# Altium project PCB_Project_VSAIND.PrjPcb
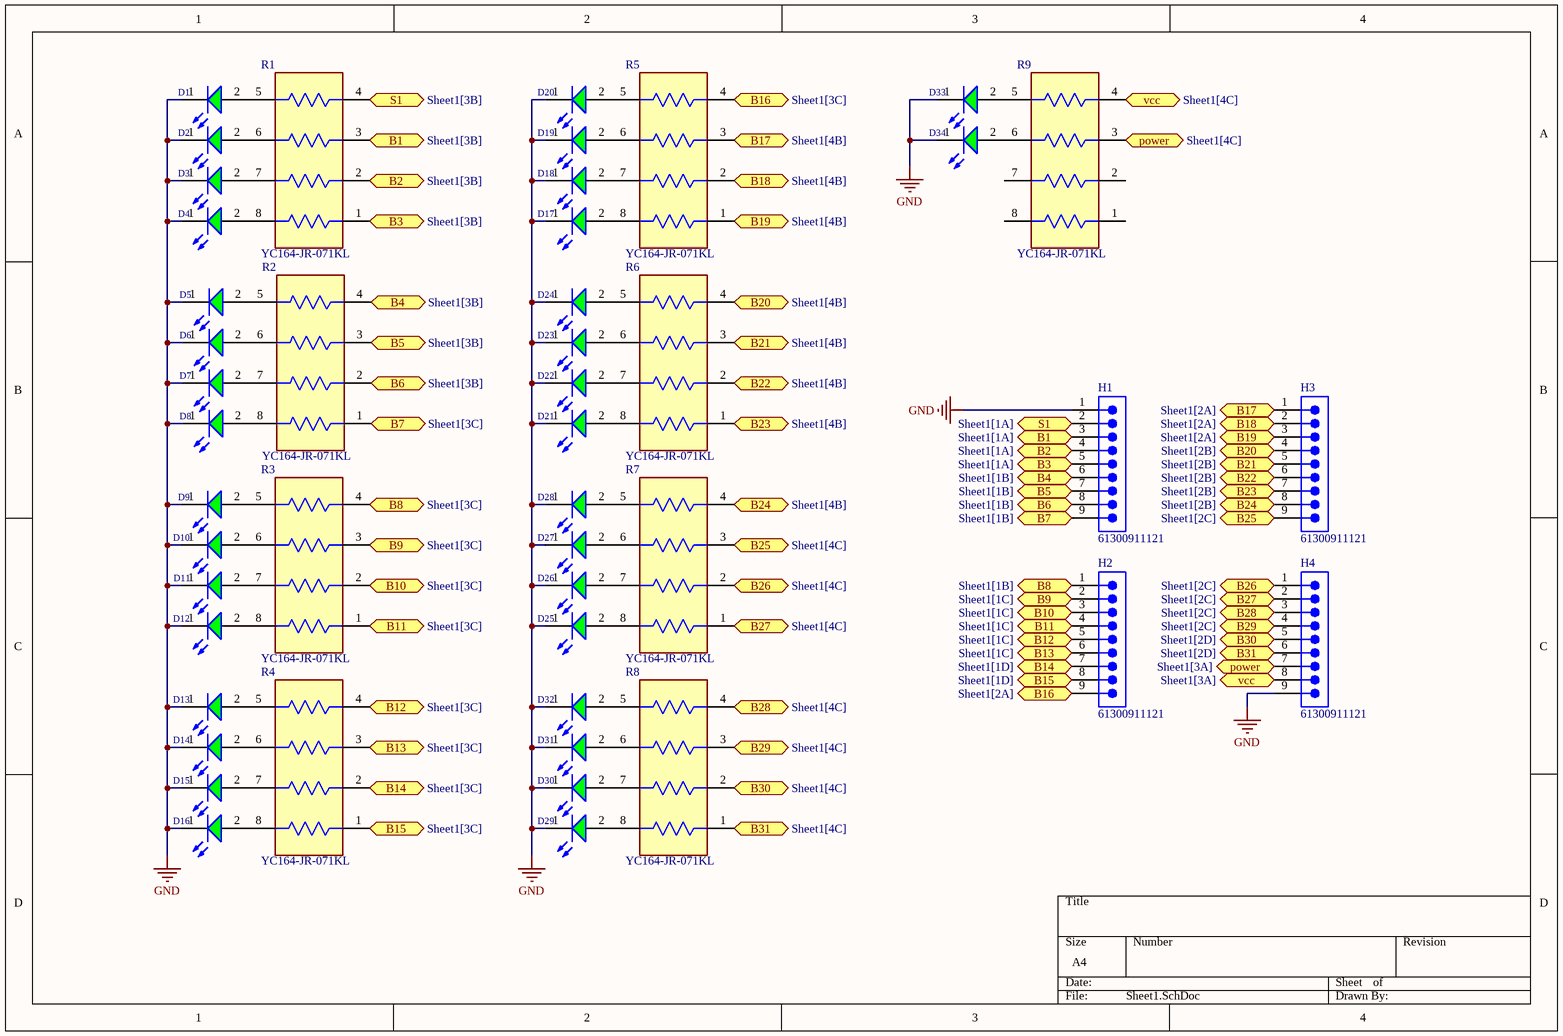
[diagram p0: Sheet1.SchDoc]
1 sheet, 47 parts. Net scope: flat (ports and power ports of the same name join across sheets).
Board file: PCB3.PcbDoc

## Sheet Sheet1.SchDoc
size A4; SheetNumber: 1; SheetTotal: 1

### Parts
D1  SHAFT  [WL-SMCW_0805_150080xx75000]  (value not drawn)
D2  B1  [WL-SMCW_0805_150080xx75000]  (value not drawn)
D3  B2  [WL-SMCW_0805_150080xx75000]  (value not drawn)
D4  B3  [WL-SMCW_0805_150080xx75000]  (value not drawn)
D5  B4  [WL-SMCW_0805_150080xx75000]  (value not drawn)
D6  B5  [WL-SMCW_0805_150080xx75000]  (value not drawn)
D7  B6  [WL-SMCW_0805_150080xx75000]  (value not drawn)
D8  B7  [WL-SMCW_0805_150080xx75000]  (value not drawn)
D9  B8  [WL-SMCW_0805_150080xx75000]  (value not drawn)
D10  B9  [WL-SMCW_0805_150080xx75000]  (value not drawn)
D11  B10  [WL-SMCW_0805_150080xx75000]  (value not drawn)
D12  B11  [WL-SMCW_0805_150080xx75000]  (value not drawn)
D13  B12  [WL-SMCW_0805_150080xx75000]  (value not drawn)
D14  B13  [WL-SMCW_0805_150080xx75000]  (value not drawn)
D15  B14  [WL-SMCW_0805_150080xx75000]  (value not drawn)
D16  B15  [WL-SMCW_0805_150080xx75000]  (value not drawn)
D17  B19  [WL-SMCW_0805_150080xx75000]  (value not drawn)
D18  B18  [WL-SMCW_0805_150080xx75000]  (value not drawn)
D19  B17  [WL-SMCW_0805_150080xx75000]  (value not drawn)
D20  B16  [WL-SMCW_0805_150080xx75000]  (value not drawn)
D21  B23  [WL-SMCW_0805_150080xx75000]  (value not drawn)
D22  B22  [WL-SMCW_0805_150080xx75000]  (value not drawn)
D23  B21  [WL-SMCW_0805_150080xx75000]  (value not drawn)
D24  B20  [WL-SMCW_0805_150080xx75000]  (value not drawn)
D25  B27  [WL-SMCW_0805_150080xx75000]  (value not drawn)
D26  B26  [WL-SMCW_0805_150080xx75000]  (value not drawn)
D27  B25  [WL-SMCW_0805_150080xx75000]  (value not drawn)
D28  B44  [WL-SMCW_0805_150080xx75000]  (value not drawn)
D29  B31  [WL-SMCW_0805_150080xx75000]  (value not drawn)
D30  B30  [WL-SMCW_0805_150080xx75000]  (value not drawn)
D31  B29  [WL-SMCW_0805_150080xx75000]  (value not drawn)
D32  B28  [WL-SMCW_0805_150080xx75000]  (value not drawn)
D33  B28  [WL-SMCW_0805_150080xx75000]  (value not drawn)
D34  B34  [WL-SMCW_0805_150080xx75000]  (value not drawn)
H1  61300911121  [61300911121]
H2  61300911121  [61300911121]
H3  61300911121  [61300911121]
H4  61300911121  [61300911121]
R1  YC164-JR-071KL  [FP-YC164-MFG]
R2  YC164-JR-071KL  [FP-YC164-MFG]
R3  YC164-JR-071KL  [FP-YC164-MFG]
R4  YC164-JR-071KL  [FP-YC164-MFG]
R5  YC164-JR-071KL  [FP-YC164-MFG]
R6  YC164-JR-071KL  [FP-YC164-MFG]
R7  YC164-JR-071KL  [FP-YC164-MFG]
R8  YC164-JR-071KL  [FP-YC164-MFG]
R9  YC164-JR-071KL  [FP-YC164-MFG]

### Ports
B1 (bidir, see Sheet1[1A]), B1 (bidir, see Sheet1[3B]), B2 (bidir, see Sheet1[1A]), B2 (bidir, see Sheet1[3B]), B3 (bidir, see Sheet1[1A]), B3 (bidir, see Sheet1[3B]), B4 (bidir, see Sheet1[1B]), B4 (bidir, see Sheet1[3B]), B5 (bidir, see Sheet1[1B]), B5 (bidir, see Sheet1[3B]), B6 (bidir, see Sheet1[1B]), B6 (bidir, see Sheet1[3B]), B7 (bidir, see Sheet1[1B]), B7 (bidir, see Sheet1[3C]), B8 (bidir, see Sheet1[1B]), B8 (bidir, see Sheet1[3C]), B9 (bidir, see Sheet1[1C]), B9 (bidir, see Sheet1[3C]), B10 (bidir, see Sheet1[1C]), B10 (bidir, see Sheet1[3C]), B11 (bidir, see Sheet1[1C]), B11 (bidir, see Sheet1[3C]), B12 (bidir, see Sheet1[1C]), B12 (bidir, see Sheet1[3C]), B13 (bidir, see Sheet1[1C]), B13 (bidir, see Sheet1[3C]), B14 (bidir, see Sheet1[1D]), B14 (bidir, see Sheet1[3C]), B15 (bidir, see Sheet1[1D]), B15 (bidir, see Sheet1[3C]), B16 (bidir, see Sheet1[2A]), B16 (bidir, see Sheet1[3C]), B17 (bidir, see Sheet1[2A]), B17 (bidir, see Sheet1[4B]), B18 (bidir, see Sheet1[2A]), B18 (bidir, see Sheet1[4B]), B19 (bidir, see Sheet1[2A]), B19 (bidir, see Sheet1[4B]), B20 (bidir, see Sheet1[2B]), B20 (bidir, see Sheet1[4B]), B21 (bidir, see Sheet1[2B]), B21 (bidir, see Sheet1[4B]), B22 (bidir, see Sheet1[2B]), B22 (bidir, see Sheet1[4B]), B23 (bidir, see Sheet1[2B]), B23 (bidir, see Sheet1[4B]), B24 (bidir, see Sheet1[2B]), B24 (bidir, see Sheet1[4B]), B25 (bidir, see Sheet1[2C]), B25 (bidir, see Sheet1[4C]), B26 (bidir, see Sheet1[2C]), B26 (bidir, see Sheet1[4C]), B27 (bidir, see Sheet1[2C]), B27 (bidir, see Sheet1[4C]), B28 (bidir, see Sheet1[2C]), B28 (bidir, see Sheet1[4C]), B29 (bidir, see Sheet1[2C]), B29 (bidir, see Sheet1[4C]), B30 (bidir, see Sheet1[2D]), B30 (bidir, see Sheet1[4C]), B31 (bidir, see Sheet1[2D]), B31 (bidir, see Sheet1[4C]), power (bidir, see Sheet1[3A]), power (bidir, see Sheet1[4C]), S1 (bidir, see Sheet1[1A]), S1 (bidir, see Sheet1[3B]), vcc (bidir, see Sheet1[3A]), vcc (bidir, see Sheet1[4C])

### Nets
GND: D1.1(K) D2.1(K) D3.1(K) D4.1(K) D5.1(K) D6.1(K) D7.1(K) D8.1(K) D9.1(K) D10.1(K) D11.1(K) D12.1(K) D13.1(K) D14.1(K) D15.1(K) D16.1(K) D17.1(K) D18.1(K) D19.1(K) D20.1(K) D21.1(K) D22.1(K) D23.1(K) D24.1(K) D25.1(K) D26.1(K) D27.1(K) D28.1(K) D29.1(K) D30.1(K) D31.1(K) D32.1(K) D33.1(K) D34.1(K) H1.1 H4.9
NetD1_2: D1.2(A) R1.5
NetD2_2: D2.2(A) R1.6
NetD3_2: D3.2(A) R1.7
NetD4_2: D4.2(A) R1.8
NetD5_2: D5.2(A) R2.5
NetD6_2: D6.2(A) R2.6
NetD7_2: D7.2(A) R2.7
NetD8_2: D8.2(A) R2.8
NetD9_2: D9.2(A) R3.5
NetD10_2: D10.2(A) R3.6
NetD11_2: D11.2(A) R3.7
NetD12_2: D12.2(A) R3.8
NetD13_2: D13.2(A) R4.5
NetD14_2: D14.2(A) R4.6
NetD15_2: D15.2(A) R4.7
NetD16_2: D16.2(A) R4.8
NetD17_2: D17.2(A) R5.8
NetD18_2: D18.2(A) R5.7
NetD19_2: D19.2(A) R5.6
NetD20_2: D20.2(A) R5.5
NetD21_2: D21.2(A) R6.8
NetD22_2: D22.2(A) R6.7
NetD23_2: D23.2(A) R6.6
NetD24_2: D24.2(A) R6.5
NetD25_2: D25.2(A) R7.8
NetD26_2: D26.2(A) R7.7
NetD27_2: D27.2(A) R7.6
NetD28_2: D28.2(A) R7.5
NetD29_2: D29.2(A) R8.8
NetD30_2: D30.2(A) R8.7
NetD31_2: D31.2(A) R8.6
NetD32_2: D32.2(A) R8.5
NetD33_2: D33.2(A) R9.5
NetD34_2: D34.2(A) R9.6
NetH1_2: H1.2 R1.4 ; port S1
NetH1_3: H1.3 R1.3 ; port B1
NetH1_4: H1.4 R1.2 ; port B2
NetH1_5: H1.5 R1.1 ; port B3
NetH1_6: H1.6 R2.4 ; port B4
NetH1_7: H1.7 R2.3 ; port B5
NetH1_8: H1.8 R2.2 ; port B6
NetH1_9: H1.9 R2.1 ; port B7
NetH2_1: H2.1 R3.4 ; port B8
NetH2_2: H2.2 R3.3 ; port B9
NetH2_3: H2.3 R3.2 ; port B10
NetH2_4: H2.4 R3.1 ; port B11
NetH2_5: H2.5 R4.4 ; port B12
NetH2_6: H2.6 R4.3 ; port B13
NetH2_7: H2.7 R4.2 ; port B14
NetH2_8: H2.8 R4.1 ; port B15
NetH2_9: H2.9 R5.4 ; port B16
NetH3_1: H3.1 R5.3 ; port B17
NetH3_2: H3.2 R5.2 ; port B18
NetH3_3: H3.3 R5.1 ; port B19
NetH3_4: H3.4 R6.4 ; port B20
NetH3_5: H3.5 R6.3 ; port B21
NetH3_6: H3.6 R6.2 ; port B22
NetH3_7: H3.7 R6.1 ; port B23
NetH3_8: H3.8 R7.4 ; port B24
NetH3_9: H3.9 R7.3 ; port B25
NetH4_1: H4.1 R7.2 ; port B26
NetH4_2: H4.2 R7.1 ; port B27
NetH4_3: H4.3 R8.4 ; port B28
NetH4_4: H4.4 R8.3 ; port B29
NetH4_5: H4.5 R8.2 ; port B30
NetH4_6: H4.6 R8.1 ; port B31
NetH4_7: H4.7 R9.3 ; port power
NetH4_8: H4.8 R9.4 ; port vcc

Not connected (* = marked no-connect by the designer): R9 1 2 7 8

### Library data of the parts
D1-D34 = CMP-1426-00009-6: WL-SMCW SMT Mono-Color Chip LED Waterclear; Max Junction Temperature (Tj): 95°C; Max Reverse Voltage (DC): 5V; Luminous Intensity: 40mcd; Color: Green; Peak Wavelength: 572nm; Wavelength: 570nm; Viewing Angle: 140°; Power Dissipation: 72mW; Forward Current: 100mA; Test Current: 20mA; Forward Voltage: 2V; Lens Style: Clear, Rectangular; Reverse Voltage: 5V; Length: 2mm; RoHS: Compliant; Min Operating Temperature: -40°C; REACH SVHC: Unknown; Packaging: Tape and Reel; Case/Package: 0805; Max Operating Temperature: 85°C; Case Code (Metric): 2012; Width: 1.25mm; Dominant Wavelength: 570nm; Mount: Surface Mount; Case Code (Imperial): 0805; Height: 700µm
H1-H4 = CMP-1502-01080-3: NexarPartId: 32855536; Current Rating: 3A; Connector Type: Male Pin; Operating Supply Voltage: 250V; Contact Resistance: 20mΩ; Pitch: 2.54mm; Number of Contacts: 9; Gender: Male; Lead Pitch: 2.54mm; REACH SVHC: Unknown; Number of Rows: 1; Mount: Through Hole; Contact Plating: Gold; Color: Black; Number of Pins: 9; Orientation: Vertical; Contact Material: Copper; Packaging: Bulk; Contact Mating Length: 5.9944mm; RoHS: Compliant; Number of Positions: 9; Termination: Solder
R1-R9 = CMP-03411-000004-1: RES ARRAY 4 RES 1K OHM 1206; Number of Terminals/Pins: 8; Resistance Tolerance: 5%; Temperature Coefficient: 200ppm/°C; Number of Circuits: 4; Resistance: 1kR; Power Per Element: 62.5mW; Voltage Rating: 50V; Circuit Type: Isolated; Case/Package: 0603; RoHS Compliant: Yes; Size Code: 0603; Tolerance: 5%; Min Operating Temperature: -55°C; Height: 0.028inch; Series: YC164; Number of Elements: 4; Length: 0.126inch; Number of Pins: 8; Number of Resistors: 4; Lead Free: Lead Free; Radiation Hardening: No; Max Operating Temperature: 155°C; Case Code (Metric): 3216; Working Voltage: 50V; Case Code (Imperial): 1206; Packaging: Cut Tape; Technology: THICK FILM; Number of Contacts: 8; Width: 0.063inch; Depth: 1.6mm; Terminal Pitch: 0.8mm; Power Dissipation: 62.5mW; Package Quantity: 1; Termination: Convex; Mount: Surface Mount; Military Standard: Not